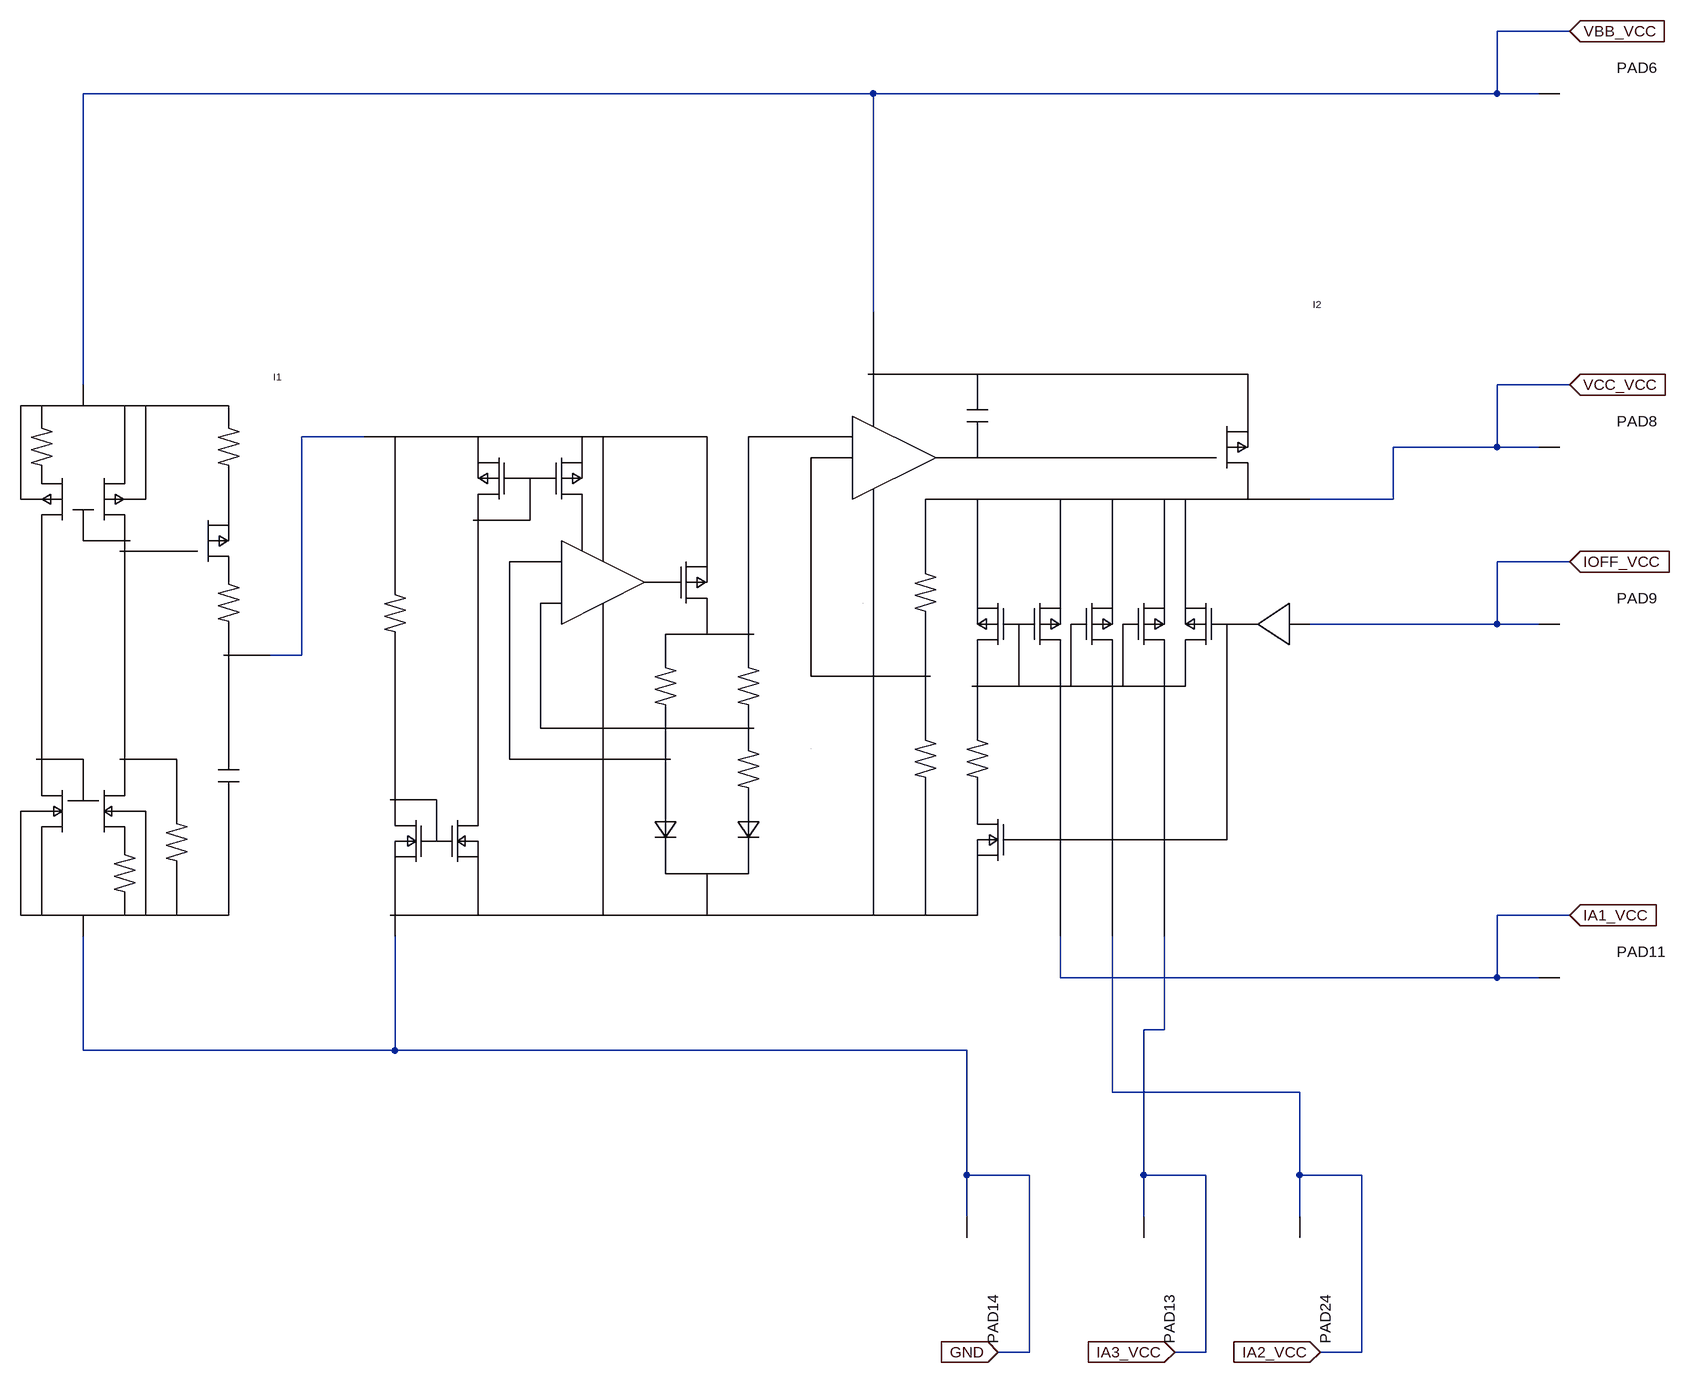
[diagram p0: schematic 462_G_Anagix.asc]
462_G_Anagix.asc, the LTspice schematic file:
Version 4
SHEET 1 7088 2000
WIRE -576 2704 -576 2608
WIRE -576 2704 -512 2704
WIRE -576 2608 -464 2608
WIRE -1248 2704 -576 2704
WIRE -1248 2704 -1248 2640
WIRE -576 1344 -576 1248
WIRE -576 1344 -512 1344
WIRE -576 1248 -464 1248
WIRE -2752 1344 -1536 1344
WIRE -2752 1792 -2752 1344
WIRE -1536 1680 -1536 1344
WIRE -1536 1344 -576 1344
WIRE -1392 3008 -1392 2816
WIRE -1344 3280 -1296 3280
WIRE -1296 3280 -1296 3008
WIRE -1392 3008 -1296 3008
WIRE -2272 2816 -1392 2816
WIRE -2752 2816 -2272 2816
WIRE -2272 2816 -2272 2640
WIRE -2752 2816 -2752 2640
WIRE -1392 3072 -1392 3008
WIRE -576 2160 -576 2064
WIRE -576 2160 -512 2160
WIRE -576 2064 -464 2064
WIRE -864 2160 -576 2160
WIRE -576 1888 -576 1792
WIRE -576 1888 -512 1888
WIRE -576 1792 -464 1792
WIRE -736 1888 -576 1888
WIRE -736 1968 -736 1888
WIRE -864 1968 -736 1968
WIRE -1120 3008 -1024 3008
WIRE -1120 3008 -1120 2784
WIRE -1024 3280 -1024 3008
WIRE -1072 3280 -1024 3280
WIRE -1120 3072 -1120 3008
WIRE -1120 2784 -1088 2784
WIRE -1088 2784 -1088 2640
WIRE -2416 1872 -2320 1872
WIRE -2416 2208 -2416 1872
WIRE -2464 2208 -2416 2208
WIRE -880 3008 -784 3008
WIRE -880 3008 -880 2880
WIRE -784 3280 -784 3008
WIRE -848 3280 -784 3280
WIRE -880 3072 -880 3008
WIRE -1168 2880 -880 2880
WIRE -1168 2880 -1168 2640
FLAG -464 1248 VBB_VCC
IOPIN -464 1248 in
FLAG -464 1792 VCC_VCC
IOPIN -464 1792 in
FLAG -464 2064 IOFF_VCC
IOPIN -464 2064 in
FLAG -464 2608 IA1_VCC
IOPIN -464 2608 in
FLAG -848 3280 IA2_VCC
IOPIN -848 3280 in
FLAG -1072 3280 IA3_VCC
IOPIN -1072 3280 in
FLAG -1344 3280 GND
IOPIN -1344 3280 in
SYMBOL PAD -1392 3152 R90
SYMATTR InstName PAD14
SYMBOL PAD -432 2160 R0
SYMATTR InstName PAD9
SYMBOL PAD -880 3152 R90
SYMATTR InstName PAD24
SYMBOL PAD -432 1888 R0
SYMATTR InstName PAD8
SYMBOL 462STUP_00_00 -2960 2272 R0
SYMATTR InstName I1
SYMBOL PAD -432 1344 R0
SYMATTR InstName PAD6
SYMBOL PAD -1120 3152 R90
SYMATTR InstName PAD13
SYMBOL 400_VREG_00 -2112 2256 R0
SYMATTR InstName I2
SYMBOL PAD -432 2704 R0
SYMATTR InstName PAD11

The netlist it stands for:
* 462_G_Anagix.asc
PAD14 GND PAD
PAD9 IOFF_VCC PAD
PAD24 IA2_VCC PAD
PAD8 VCC_VCC PAD
XI1 VBB_VCC GND N001 462STUP_00_00  ; pins VBB ? VREG
PAD6 VBB_VCC PAD
PAD13 IA3_VCC PAD
XI2 IOFF_VCC IA3_VCC GND N001 VBB_VCC VCC_VCC IA2_VCC IA1_VCC 400_VREG_00  ; pins IOFF IA3 GND VREG VBB VCC IA2 IA1
PAD11 IA1_VCC PAD
.backanno
.end